# Altium schematic sheet TOUCH.SchDoc: PROTO QTOUCH (TOUCH)
size B; Author: Sébastien Gélinas; Organization: SmartHalo; Address1: 5445 de Gaspé; Address2: Montréal, QC; Address3: Canada; Address4: H2T 3B2; Revision: 1; SheetNumber: 2; SheetTotal: 4
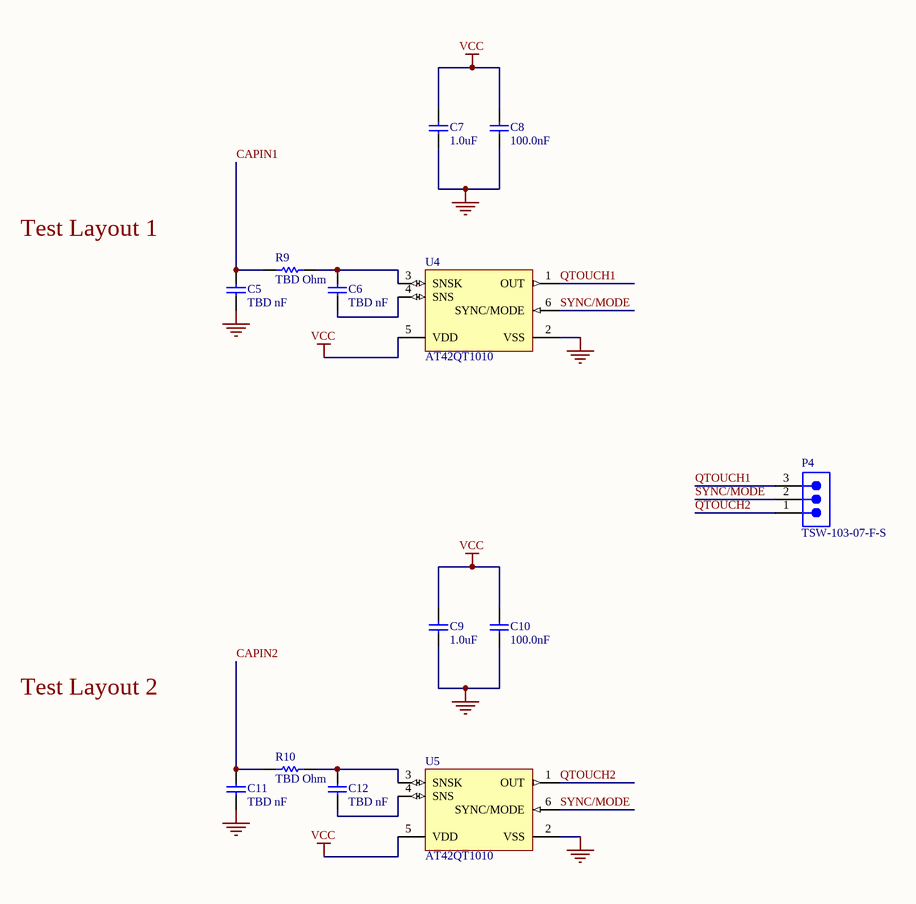
[diagram p0: TOUCH.SchDoc]

## Parts
C5  TBD nF  [CAPC0603(1608)100_N]
C6  TBD nF  [CAPC0603(1608)100_N]
C7  1.0uF  [CAPC0603(1608)100_N]
C8  100.0nF  [CAPC0603(1608)100_N]
C9  1.0uF  [CAPC0603(1608)100_N]
C10  100.0nF  [CAPC0603(1608)100_N]
C11  TBD nF  [CAPC0603(1608)100_N]
C12  TBD nF  [CAPC0603(1608)100_N]
P4  TSW-103-07-F-S  [SMTC-TSW-103-07-X-S]
R9  TBD Ohm  [RESC0603(1608)_M]
R10  TBD Ohm  [RESC0603(1608)_M]
U4  AT42QT1010  [6ST1_N]
U5  AT42QT1010  [6ST1_N]

## Nets
GND: C5.2 C7.2 C8.2 C9.2 C10.2 C11.2 U4.2(VSS) U5.2(VSS)
VCC: C7.1 C8.1 C9.1 C10.1 U4.5(VDD) U5.5(VDD)
CAPIN1: C5.1 R9.2
CAPIN2: C11.1 R10.2
QTOUCH1: P4.3 U4.1(OUT)
QTOUCH2: P4.1 U5.1(OUT)
SYNC/MODE: P4.2 U4.6(SYNC/MODE) U5.6(SYNC/MODE)
NetC6_1: C6.1 U4.4(SNS)
NetC6_2: C6.2 R9.1 U4.3(SNSK)
NetC12_1: C12.1 U5.4(SNS)
NetC12_2: C12.2 R10.1 U5.3(SNSK)

## Notes on the sheet
- Test Layout 1
- Test Layout 2
- Title
- Size:
- Date:
- B
- Author:
- Time:
- Sheet
- Revision:
- of
- File:

## Library data of the parts
C5 C7-C11 = CAP0603: Chip Cap 0603 X7R 10%; Part Number: C0402-1n0; Note: Chip Cap X7R 10%; Artikkelnr Noca: 20039223; Published: 2009-05-08; LatestRevisionDate: 2009-11-23; Publisher: Nordic Semiconductor; Manufacturer: *; Manufacturer Part Number: *; Datasheet: *; Footprint: 0603; Pin Count: 2; Supplier: *
  C5 C11: Value: TBD nF
  C7 C9: Value: 1.0uF
  C8 C10: Value: 100.0nF
C6 C12 = CAP0603: Chip Cap 0603 C0G best or X7R or X5R 10%; Part Number: C0402-1n0; Note: Chip Cap C0G best or X7R or X5R TBD%; Artikkelnr Noca: 20039223; Published: 2009-05-08; LatestRevisionDate: 2009-11-23; Publisher: Nordic Semiconductor; Value: TBD nF; Manufacturer: *; Manufacturer Part Number: *; Datasheet: *; Footprint: 0603; Pin Count: 2; Supplier: *
P4 = CMP-1024-00331-1: 0.025" SQ Post Header, Through-hole, Vertical, -55 to 125 degC, 2.54 mm Pitch, 3-Pin, Male, RoHS; Manufacturer: Samtec; Pitch: 2.54 mm; DatasheetVersion: F-214; ComponentLink1Description: Manufacturer URL; ComponentLink3URL: http://www.samtec.com/documents/webfiles/cpdf/TSW-XXX-XX-XXX-X-XX-XXX-MKT.pdf; Mounting Technology: Through-hole; PackageDescription: .025[0.64] SQ. Post Terminal Strip Assembly; Temperature Range: -55 to 125 degC; ComponentLink3Description: Package Specification; Orientation: Vertical; PartNumber: TSW-103-07-F-S; RoHS: True; PackageVersion: DM, 8/1988; ComponentLink2Description: Datasheet; ComponentLink1URL: http://www.samtec.com; ComponentLink2URL: http://www.samtec.com/documents/webfiles/pdf/TSW_TH.PDF; PackageReference: TSW-103-07-X-S
R9 R10 = CMP-1012-00090-1: TBDR TBDW 10% <200ppm/C 0603 (1608 Metric)  SMD; Case-Metric: 1608; Case-EIA: 0603; Tolerance: 10 %; Technology: SMT; Power: TBD W; Value: TBD Ohm
U4 U5 = AT42QT1010: Single-key QTouch® Touch Sensor IC; Manufacturer: Atmel